# EAGLE schematic BOSS-USB-Isolator (EAGLE 9.6.2)
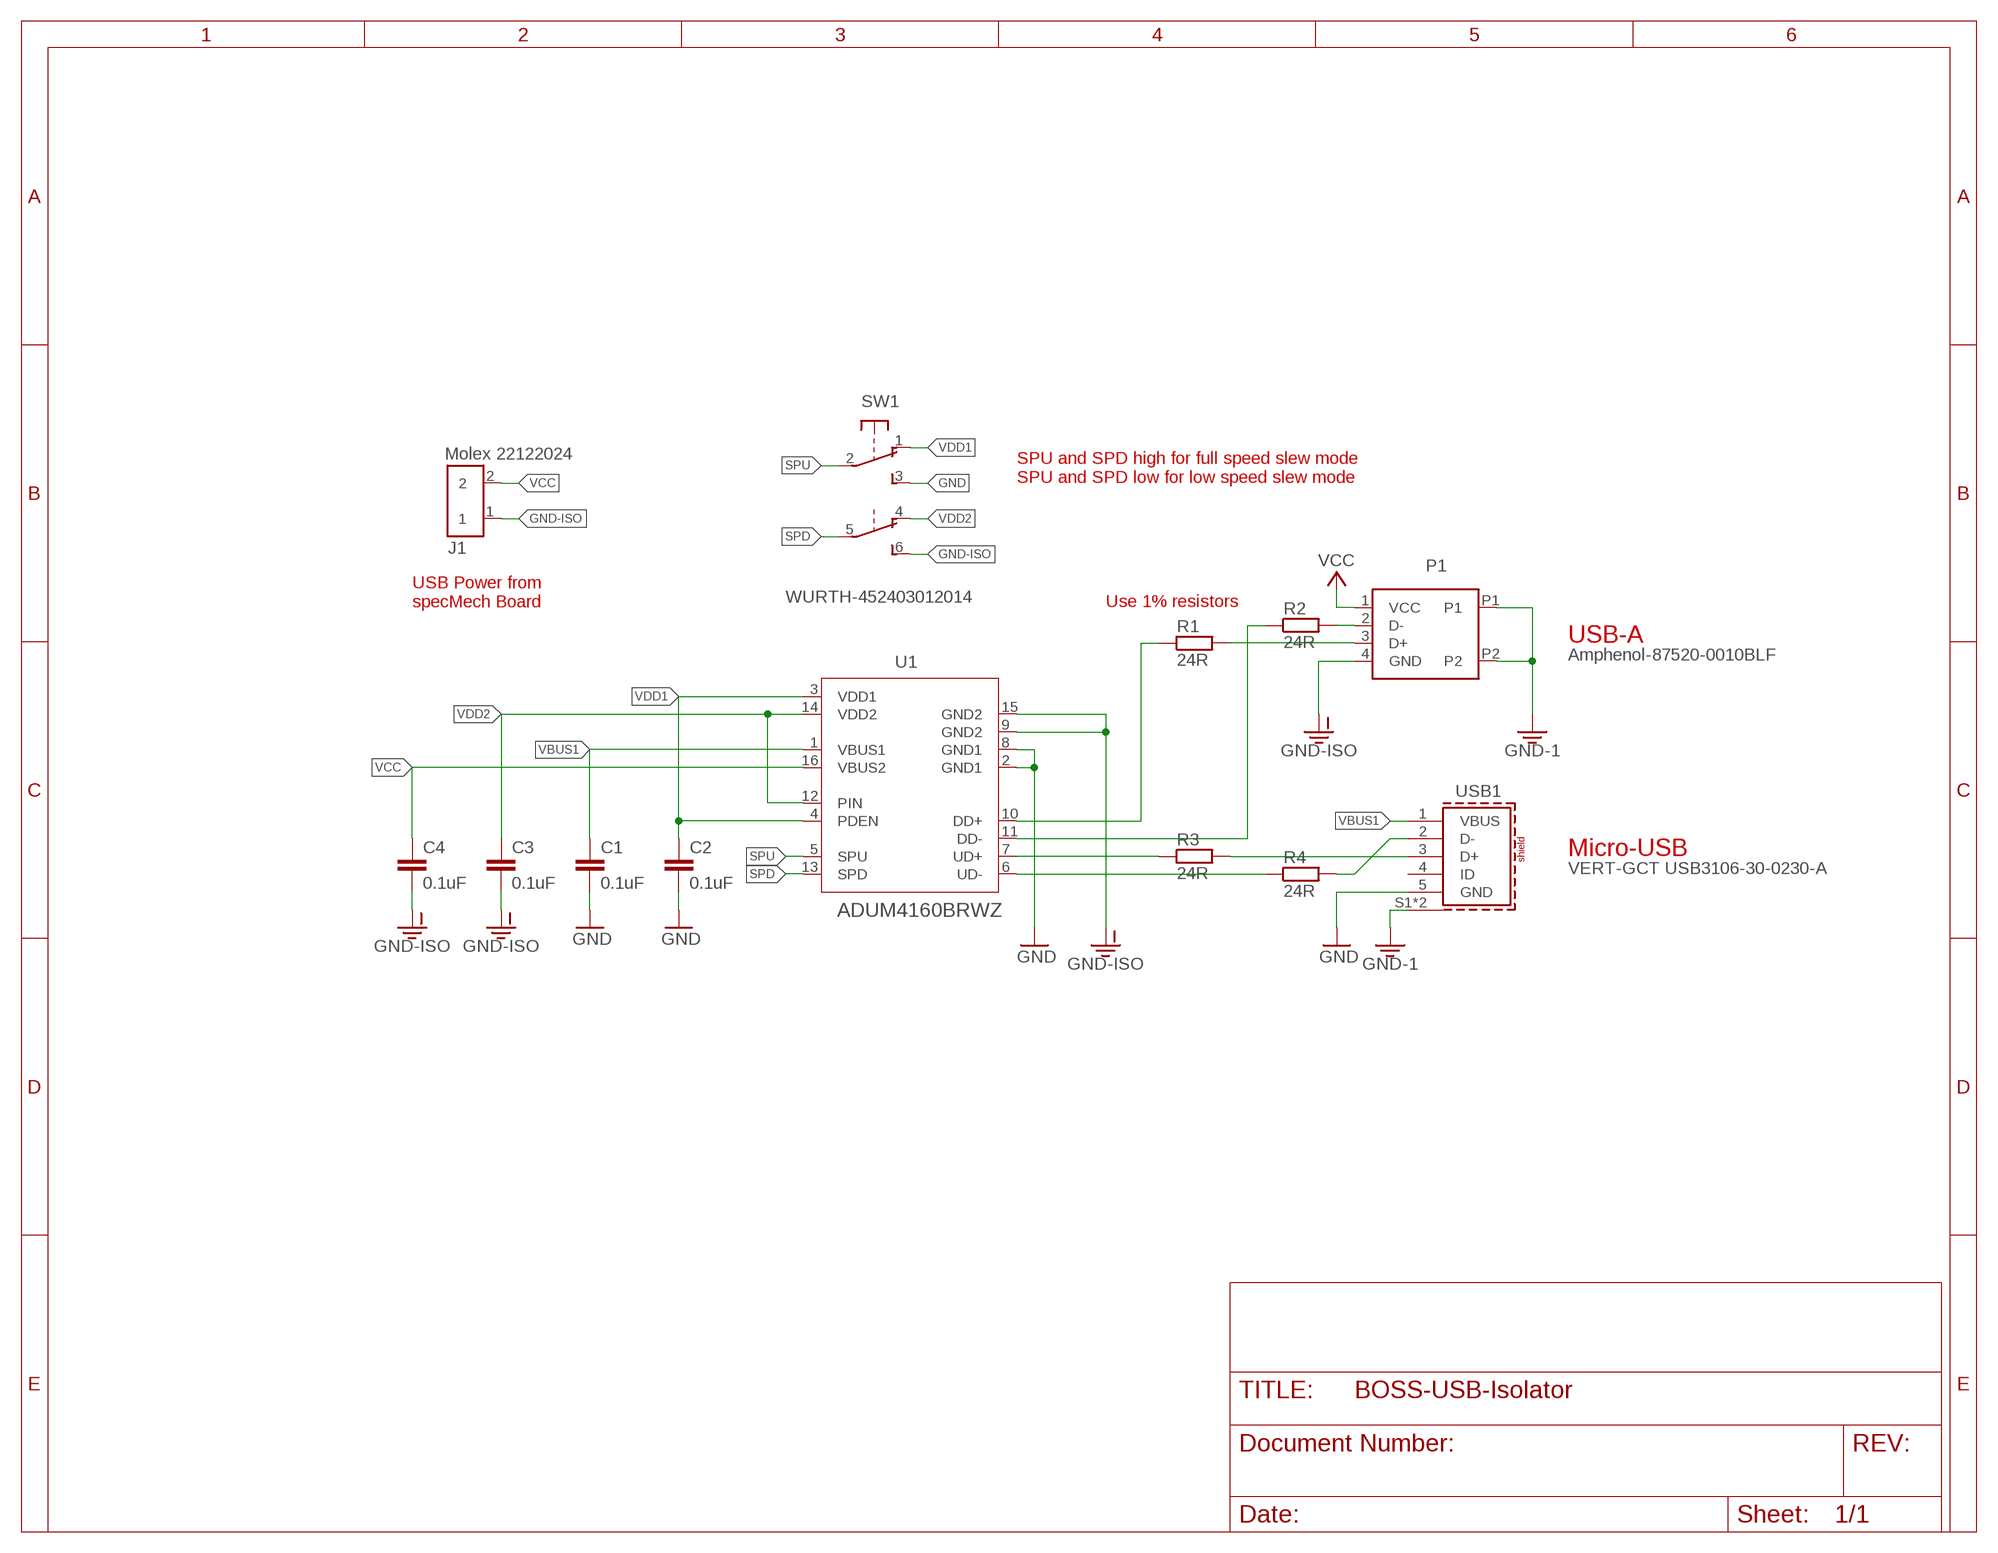
[diagram p0: schematic, sheet 1]

## Parts
C1  0.1uF  C-EUC0805  [C0805]
C2  0.1uF  C-EUC0805  [C0805]
C3  0.1uF  C-EUC0805  [C0805]
C4  0.1uF  C-EUC0805  [C0805]
J1  Molex 22122024  PINHD-1X2RA-MOLEX-22122024MOLEX-22122024  [1X02RA-MOLEX-22122024]
P1  Amphenol-87520-0010BLF  USBA-87520-0010BLF  [FCI_87520-0010BLF]
R1  24R  R-EU_R0805  [R0805]
R2  24R  R-EU_R0805  [R0805]
R3  24R  R-EU_R0805  [R0805]
R4  24R  R-EU_R0805  [R0805]
SW1  WURTH-452403012014  DPDT-WURTH-WS-SLSV  [WS-SLSV]
U1  ADUM4160BRWZ  [RW_16_ADI]
USB1  VERT-GCT USB3106-30-0230-A  USB-VERT-GCT  [USB-VERT-GCT-USB3106-30-0230-A]

## Nets
GND: C1.2 C2.2 SW1.3 U1.2(GND1) U1.8(GND1) USB1.5(GND)
GND-1: P1.P1 P1.P2 USB1.S1(SHIELD) USB1.S2(SHIELD)
GND-ISO: C3.2 C4.2 J1.1 P1.4(GND) SW1.6 U1.9(GND2) U1.15(GND2)
N$1: R1.1 U1.10(DD+)
N$2: R4.2 USB1.2(D-)
N$3: R2.1 U1.11(DD-)
N$4: R3.1 U1.7(UD+)
N$5: R4.1 U1.6(UD-)
N$7: R3.2 USB1.3(D+)
N$8: P1.2(D-) R2.2
N$9: P1.3(D+) R1.2
SPD: SW1.5 U1.13(SPD)
SPU: SW1.2 U1.5(SPU)
VBUS1: C1.1 U1.1(VBUS1) USB1.1(VBUS)
VCC: C4.1 J1.2 P1.1(VCC) U1.16(VBUS2)
VDD1: C2.1 SW1.1 U1.3(VDD1) U1.4(PDEN)
VDD2: C3.1 SW1.4 U1.12(PIN) U1.14(VDD2)
Unconnected: USB1.4(ID)

## Notes on the sheet
- SPU and SPD high for full speed slew mode
  SPU and SPD low for low speed slew mode
- USB Power from
  specMech Board
- Use 1% resistors
- USB-A
- Micro-USB

## Library data of the parts
C1-C4 = AUmlib:C-EU: CAPACITOR, European symbol; SPICEPREFIX: C
J1 = AUmlib:PINHD-1X2RA-MOLEX-22122024
P1 = AUmlib:USBA-87520-0010BLF: USB - A USB 2.0 Receptacle Connector 4 Position Through Hole, Right Angle; DESCRIPTION: USB-A (USB TYPE-A) USB 2.0 Receptacle Connector 4 Position Through Hole, Right Angle; DIGI-KEY_PART_NUMBER: 609-1045-ND; MF: Amphenol ICC; MP: 87520-0010BLF; PACKAGE: None; PURCHASE-URL: https://pricing.snapeda.com/search/part/87520-0010BLF/?ref=eda
R1-R4 = AUmlib:R-EU_: RESISTOR, European symbol; SPICEPREFIX: R
SW1 = AUmlib:DPDT-WURTH-WS-SLSV
U1 = AUmlib:ADUM4160BRWZ; BUILT_BY: EMA_UL_Team; MANUFACTURER_PART_NUMBER: ADUM4160BRWZ; SOURCELIBRARY: Analog_2015-12-15; VENDOR: Analog Devices Inc
USB1 = AUmlib:USB-VERT-GCT